# EAGLE schematic charge_controller (EAGLE 9.5.1)
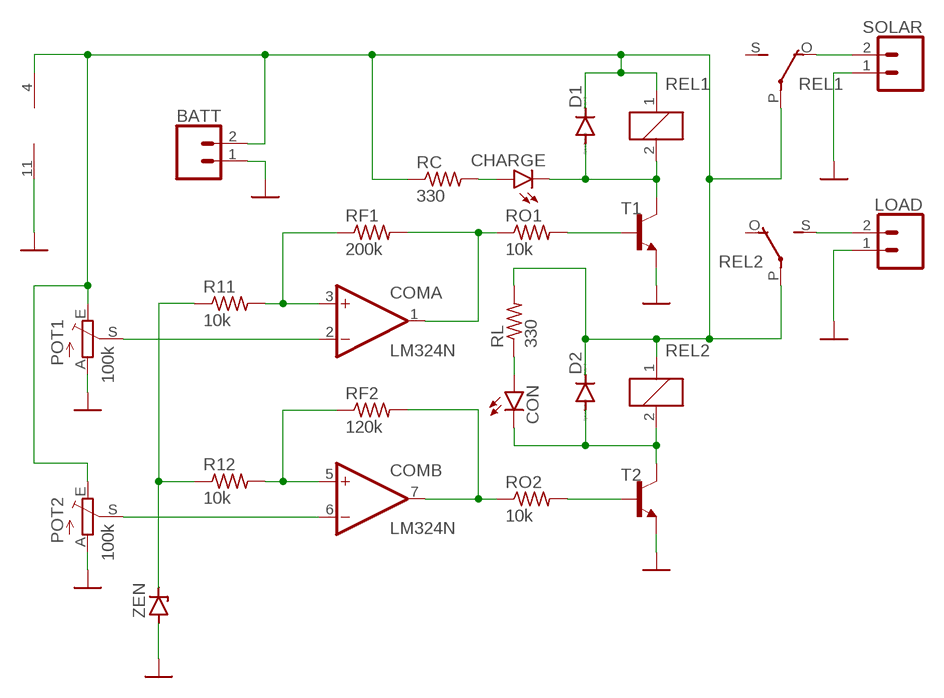
[diagram p0: schematic, sheet 1]

## Parts
BATT  CONN_02PTH4  [1X02_XTRA_BIG]
CHARGE  LED5MM  [LED5MM]
COM  LM324N  [DIL14]
CON  LED5MM  [LED5MM]
D1  1N4148DO35-7  [DO35-7]
D2  1N4148DO35-7  [DO35-7]
LOAD  CONN_02PTH4  [1X02_XTRA_BIG]
POT1  100k  TRIM_EU-CT6  [CT6]
POT2  100k  TRIM_EU-CT6  [CT6]
R11  10k  R-US_0207/10  [0207/10]
R12  10k  R-US_0207/10  [0207/10]
RC  330  R-US_0207/10  [0207/10]
REL1  G5L  [G5LE]
REL2  G5L  [G5LE]
RF1  200k  R-US_0207/10  [0207/10]
RF2  120k  R-US_0207/10  [0207/10]
RL  330  R-US_0207/10  [0207/10]
RO1  10k  R-US_0207/10  [0207/10]
RO2  10k  R-US_0207/10  [0207/10]
SOLAR  CONN_02PTH4  [1X02_XTRA_BIG]
T1  MPS2222A-NPN-TO92-CBE  [TO92-CBE]
T2  MPS2222A-NPN-TO92-CBE  [TO92-CBE]
ZEN  BZD23  [SOD81]

## Nets
GND: BATT.1 COM.11(P:V-) LOAD.1 POT1.A POT2.A SOLAR.1 T1.E T2.E ZEN.A
N$1: COM.3(A:+IN) R11.2 RF1.1
N$2: COM.5(B:+IN) R12.2 RF2.1
N$3: COM.2(A:-IN) POT1.S
N$4: COM.6(B:-IN) POT2.S
N$5: R11.1 R12.1 ZEN.C
N$6: COM.7(B:OUT) RF2.2 RO2.1
N$7: COM.1(A:OUT) RF1.2 RO1.1
N$8: RO1.2 T1.B
N$9: RO2.2 T2.B
N$10: CON.K(C) D2.A REL2.2 T2.C
N$11: REL1.O(2:O) SOLAR.2
N$12: CHARGE.K(C) D1.A REL1.2 T1.C
N$13: LOAD.2 REL2.S(2:S)
N$14: BATT.2 COM.4(P:V+) D1.C D2.C POT1.E POT2.E RC.1 REL1.1 REL1.P(2:P) REL2.1 REL2.P(2:P) RL.2
N$15: CHARGE.A RC.2
N$18: CON.A RL.1
Unconnected: COM.8(C:OUT) COM.9(C:-IN) COM.10(C:+IN) COM.12(D:+IN) COM.13(D:-IN) COM.14(D:OUT) REL1.S(2:S) REL2.O(2:O)

## Library data of the parts
BATT LOAD SOLAR = atick_connector:CONN_02: Multi connection point. Often used as Generic Header-pin footprint for 0.1 inch spaced/style header connections On any of the 0.1 inch spaced packages, you can populate with these: Break Away Headers - Straight <https://www.sparkfun.com/products/116> (PRT-00116) Break Away Male Headers - Right Angle <https://www.sparkfun.com/products/553> (PRT-00553) Female Headers <https://www.sparkfun.com/products/115> (PRT-00115) Break Away Headers - Machine Pin <https://www.sparkfun.com/products/117> (PRT-00117) Break Away Female Headers - Swiss Machine Pin <https://www.sparkfun.com/products/743> (PRT-00743) For SCREWTERMINALS and SPRING TERMINALS visit here: Screw Terimnals on SparkFun.com <https://www.sparkfun.com/search/results?term=Screw+Terminals> (5mm/3.5mm/2.54mm spacing) This device is also useful as a general connection point to wire up your design to another part of your project. Our various solder wires solder well into these plated through hole pads. Hook-Up Wire - Assortment (Stranded, 22 AWG) <https://www.sparkfun.com/products/11375> (PRT-11375) Hook-Up Wire - Assortment (Solid Core, 22 AWG) <https://www.sparkfun.com/products/11367> (PRT-11367) View the entire wire category on our website here <https://www.sparkfun.com/categories/141> Special notes: Molex polarized connector foot print use with: PRT-08233 with associated crimp pins and housings. 2.54_SCREWTERM for use with PRT-10571. 3.5mm Screw Terminal footprints for PRT-08084 5mm Screw Terminal footprints for use with PRT-08432
CHARGE CON = atick_led:LED: LED OSRAM: - CHIPLED LG R971, LG N971, LY N971, LG Q971, LY Q971, LO R971, LY R971 LH N974, LH R974 LS Q976, LO Q976, LY Q976 LO Q996 - Hyper CHIPLED LW Q18S LB Q993, LB Q99A, LB R99A - SideLED LS A670, LO A670, LY A670, LG A670, LP A670 LB A673, LV A673, LT A673, LW A673 LH A674 LY A675 LS A676, LA A676, LO A676, LY A676, LW A676 LS A679, LY A679, LG A679 - Hyper Micro SIDELED® LS Y876, LA Y876, LO Y876, LY Y876 LT Y87S - SmartLED LW L88C, LW L88S LB L89C, LB L89S, LG L890 LS L89K, LO L89K, LY L89K LS L896, LA L896, LO L896, LY L896 - TOPLED LS T670, LO T670, LY T670, LG T670, LP T670 LSG T670, LSP T670, LSY T670, LOP T670, LYG T670 LG T671, LOG T671, LSG T671 LB T673, LV T673, LT T673, LW T673 LH T674 LS T676, LA T676, LO T676, LY T676, LB T676, LH T676, LSB T676, LW T676 LB T67C, LV T67C, LT T67C, LS T67K, LO T67K, LY T67K, LW E67C LS E67B, LA E67B, LO E67B, LY E67B, LB E67C, LV E67C, LT E67C LW T67C LS T679, LY T679, LG T679 LS T770, LO T770, LY T770, LG T770, LP T770 LB T773, LV T773, LT T773, LW T773 LH T774 LS E675, LA E675, LY E675, LS T675 LS T776, LA T776, LO T776, LY T776, LB T776 LHGB T686 LT T68C, LB T68C - Hyper Mini TOPLED® LB M676 - Mini TOPLED Santana® LG M470 LS M47K, LO M47K, LY M47K Source: http://www.osram.convergy.de LUXEON: - LUMILED® LXK2-PW12-R00, LXK2-PW12-S00, LXK2-PW14-U00, LXK2-PW14-V00 LXK2-PM12-R00, LXK2-PM12-S00, LXK2-PM14-U00 LXK2-PE12-Q00, LXK2-PE12-R00, LXK2-PE12-S00, LXK2-PE14-T00, LXK2-PE14-U00 LXK2-PB12-K00, LXK2-PB12-L00, LXK2-PB12-M00, LXK2-PB14-N00, LXK2-PB14-P00, LXK2-PB14-Q00 LXK2-PR12-L00, LXK2-PR12-M00, LXK2-PR14-Q00, LXK2-PR14-R00 LXK2-PD12-Q00, LXK2-PD12-R00, LXK2-PD12-S00 LXK2-PH12-R00, LXK2-PH12-S00 LXK2-PL12-P00, LXK2-PL12-Q00, LXK2-PL12-R00 Source: www.luxeon.com KINGBRIGHT: KA-3528ASYC Source: www.kingbright.com
COM = linear:LM324: OP AMP
D1 D2 = diode:1N4148: DIODE high speed (Philips)
POT1 POT2 = pot_atick:TRIM_EU-: POTENTIOMETER
R11 R12 RC RF1 RF2 RL RO1 RO2 = atick_rcl:R-US_: RESISTOR, American symbol; SPICEPREFIX: R
REL1 REL2 = atick_relay:G5L: RELAY 1 x switch, 10 A/120 V AC, 8 A/30 V ADC, Omron; OC_FARNELL: unknown; OC_NEWARK: unknown
T1 T2 = transistor:*-NPN-: NPN Transistror BF959 corrected 2008.03.06
ZEN = diode:BZD23: Z DIODE